# Altium schematic sheet Display&Key&Eye.SchDoc
size A4
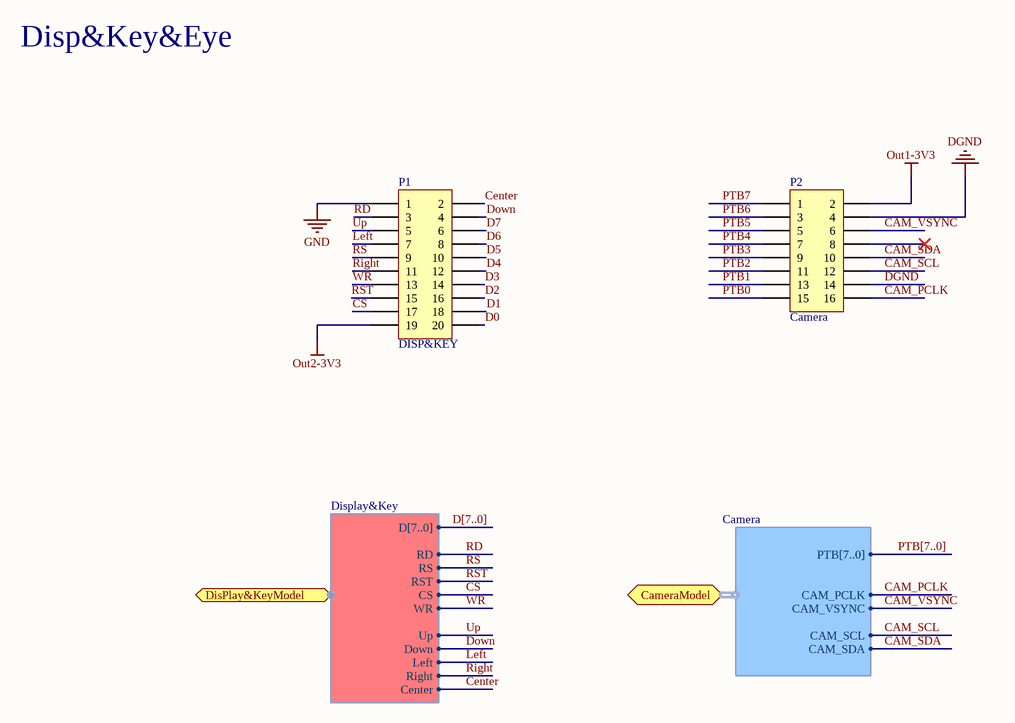
[diagram p0: Display&Key&Eye.SchDoc]

## Parts
P1  DISP&KEY  [HDR2X10]
P2  Camera  [HDR2X8]

## Ports
CameraModel (harness Camera), DisPlay&KeyModel (harness Display&Key)

## Harnesses
Display&Key: D[7..0], RD, RS, RST, CS, Up, Down, Left, Right, Center, WR
Camera: PTB[7..0], CAM_PCLK, CAM_SCL, CAM_VSYNC, CAM_SDA

## Nets
DGND: P2.4 P2.14
GND: P1.1
Out1-3V3: P2.2
Out2-3V3: P1.19
CAM_PCLK: P2.16 ; port CameraModel.CAM_PCLK
CAM_SCL: P2.12 ; port CameraModel.CAM_SCL
CAM_SDA: P2.10 ; port CameraModel.CAM_SDA
CAM_VSYNC: P2.6 ; port CameraModel.CAM_VSYNC
Center: P1.2 ; port DisPlay&KeyModel.Center
CS: P1.17 ; port DisPlay&KeyModel.CS
D0: P1.20
D1: P1.18
D2: P1.16
D3: P1.14
D4: P1.12
D5: P1.10
D6: P1.8
D7: P1.6
Down: P1.4 ; port DisPlay&KeyModel.Down
Left: P1.7 ; port DisPlay&KeyModel.Left
PTB0: P2.15
PTB1: P2.13
PTB2: P2.11
PTB3: P2.9
PTB4: P2.7
PTB5: P2.5
PTB6: P2.3
PTB7: P2.1
~{RS}: P1.9 ; port DisPlay&KeyModel.RS
RD: P1.3 ; port DisPlay&KeyModel.RD
Right: P1.11 ; port DisPlay&KeyModel.Right
RST: P1.15 ; port DisPlay&KeyModel.RST
Up: P1.5 ; port DisPlay&KeyModel.Up
WR: P1.13 ; port DisPlay&KeyModel.WR

Not connected (* = marked no-connect by the designer): P2 8*

## Buses and harness runs
bus D[7..0]
bus PTB[7..0]

## Notes on the sheet
- Disp&Key&Eye

## Library data of the parts
P1 = Header 10X2: Header, 10-Pin, Dual row; LatestRevisionDate: 17-Jul-2002; LatestRevisionNote: Re-released for DXP Platform.; Publisher: Altium Limited
P2 = Header 8X2: Header, 8-Pin, Dual row; LatestRevisionDate: 17-Jul-2002; LatestRevisionNote: Re-released for DXP Platform.; Publisher: Altium Limited